# EasyEDA schematic SCH_Pico-android-remote_2025-09-06.json
TITLE: pico-GB-printer + remote control; REV: 1.0; Date: 2025-09-03; Sheet: 1/1; Drawn By: raphael.boichot; Company: Raphaël BOICHOT
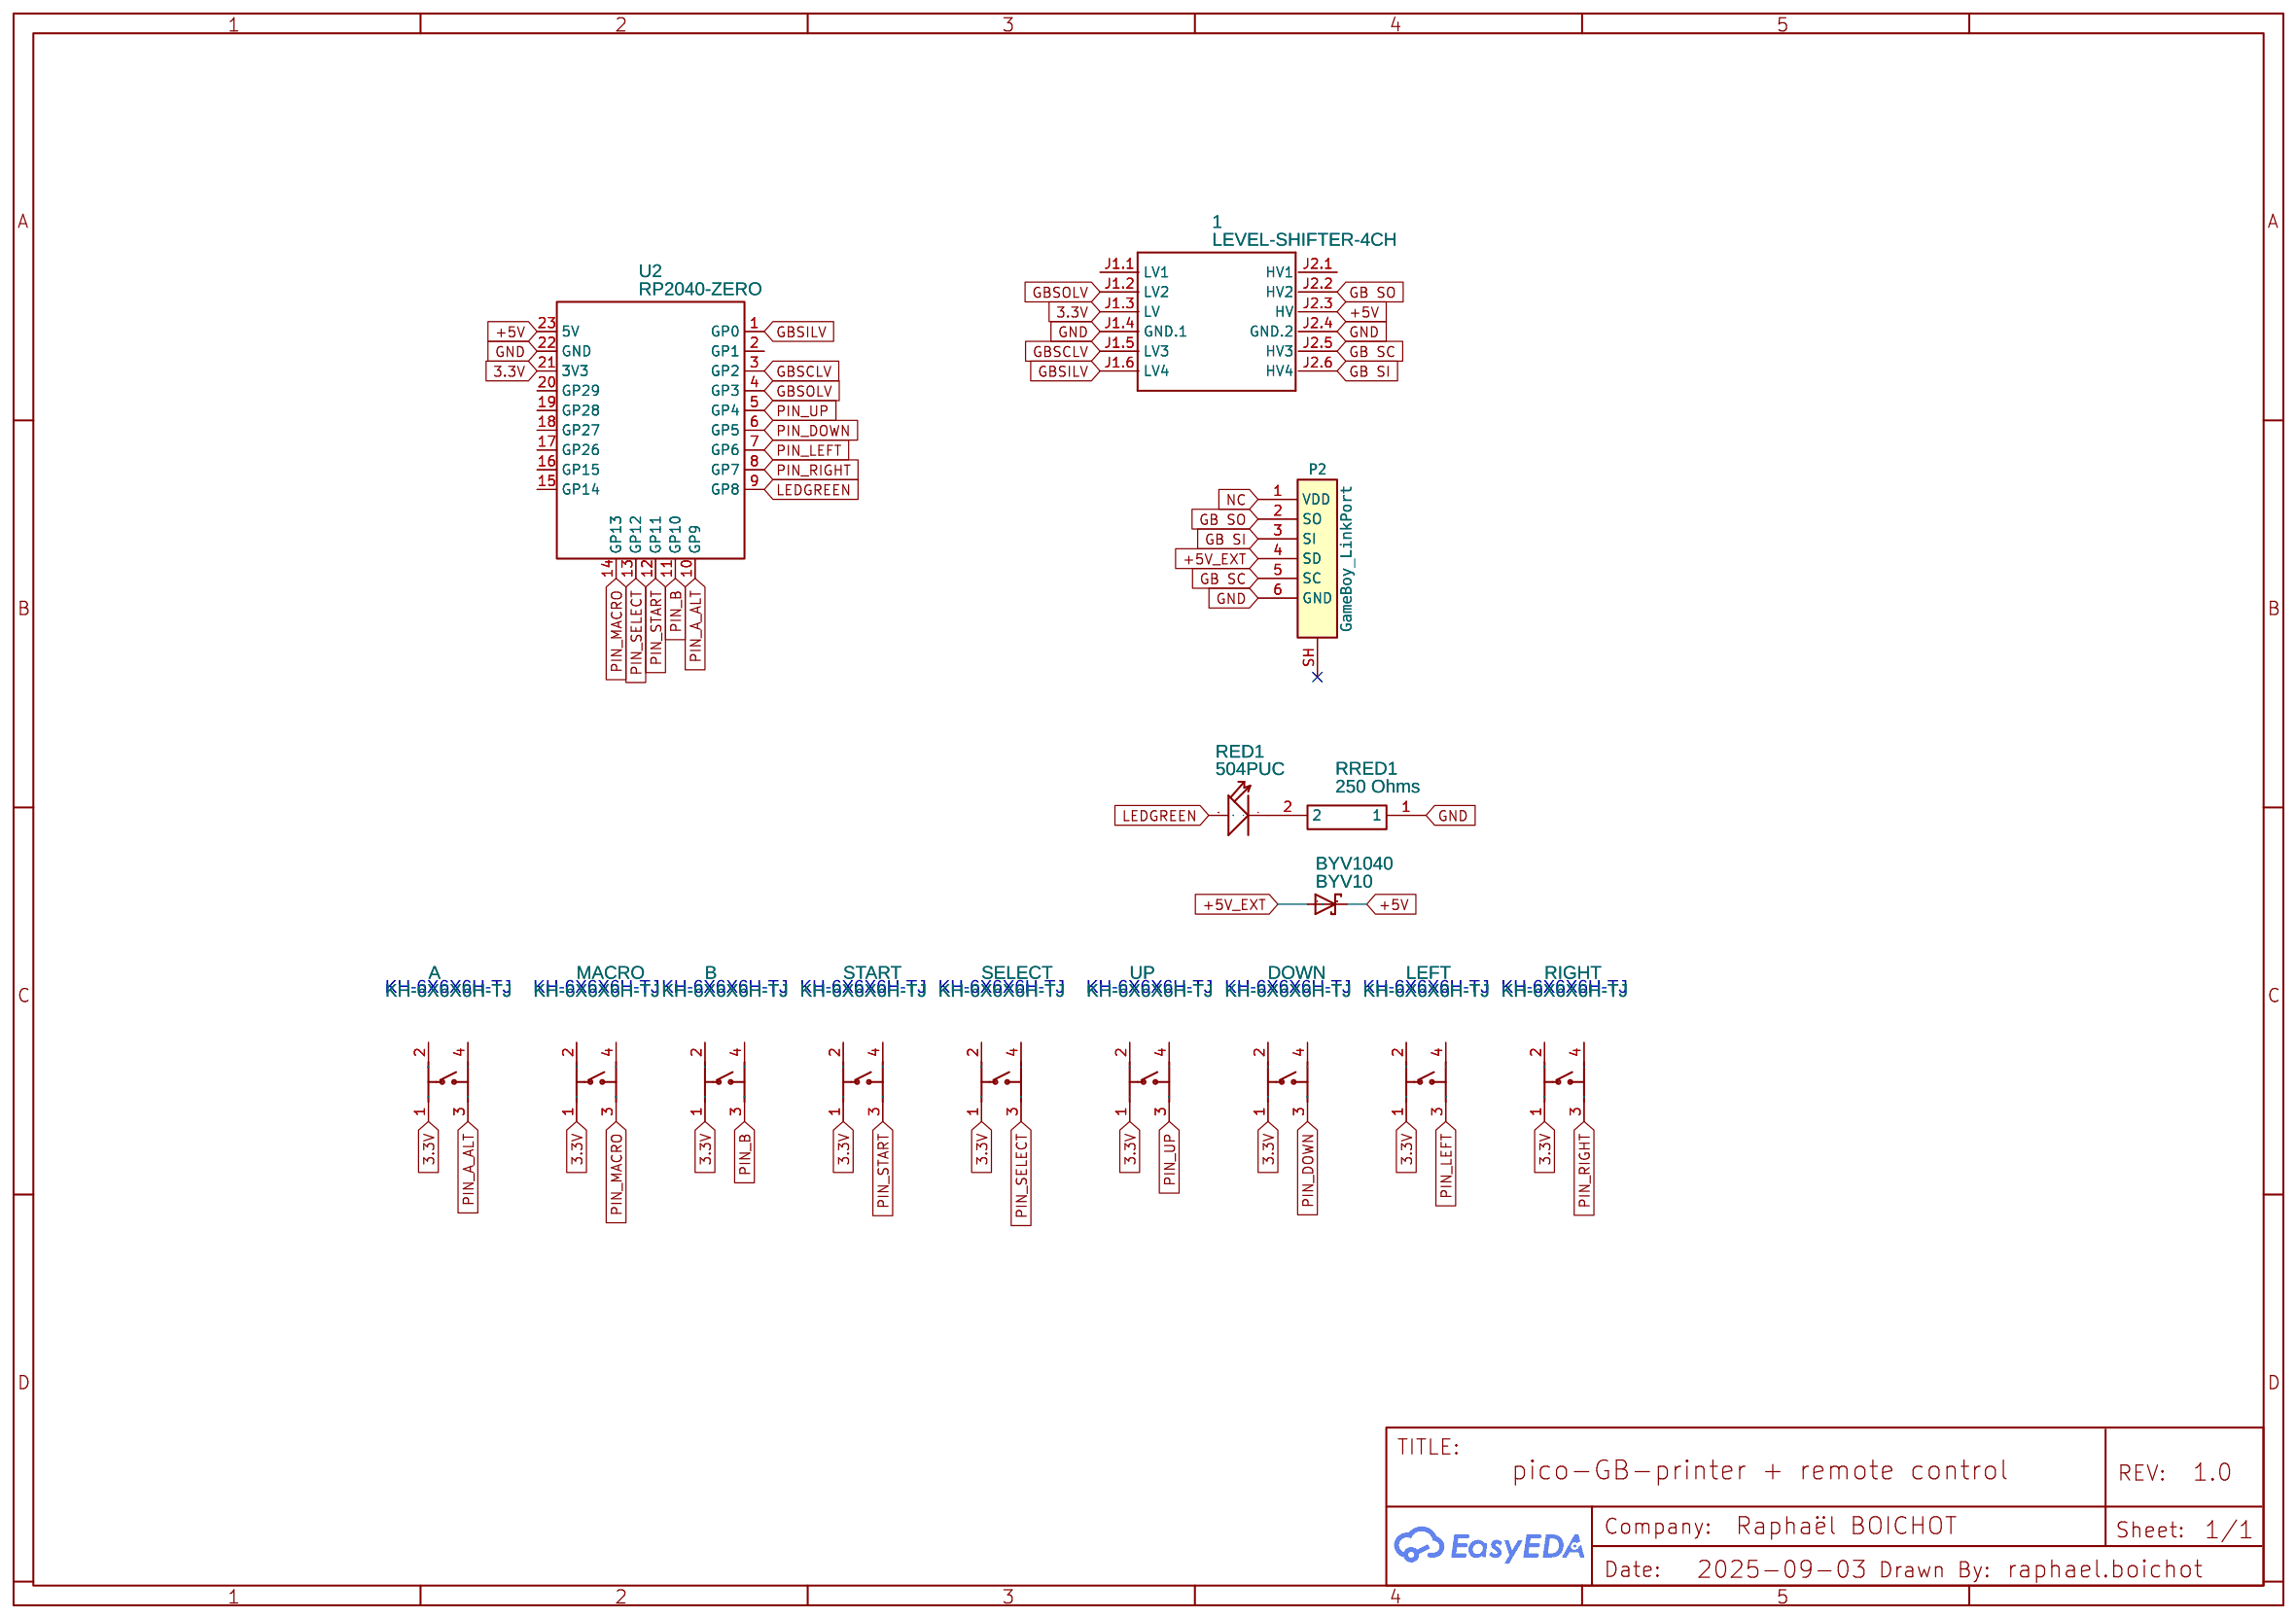
[diagram p0: schematic sheet]

## Parts
1  LEVEL-SHIFTER-4CH  [LEVEL-SHIFTER-4CH]
A  KH-6X6X6H-TJ  [SW-TH_4P-L6.0-W6.0-P4.50-LS6.5]
B  KH-6X6X6H-TJ  [SW-TH_4P-L6.0-W6.0-P4.50-LS6.5]
BYV1040  BYV10  [DO41-10]
DOWN  KH-6X6X6H-TJ  [SW-TH_4P-L6.0-W6.0-P4.50-LS6.5]
LEFT  KH-6X6X6H-TJ  [SW-TH_4P-L6.0-W6.0-P4.50-LS6.5]
MACRO  KH-6X6X6H-TJ  [SW-TH_4P-L6.0-W6.0-P4.50-LS6.5]
P2  GameBoy_LinkPort  [GAMEBOY_LINKPORT_MGB_HORIZONTAL]
RED1  504PUC  [LED2-2.54-D5.0MM]
RIGHT  KH-6X6X6H-TJ  [SW-TH_4P-L6.0-W6.0-P4.50-LS6.5]
RRED1  250 Ohms  [RESISTOR]
SELECT  KH-6X6X6H-TJ  [SW-TH_4P-L6.0-W6.0-P4.50-LS6.5]
START  KH-6X6X6H-TJ  [SW-TH_4P-L6.0-W6.0-P4.50-LS6.5]
U2  RP2040-ZERO  [RP2040-ZERO]
UP  KH-6X6X6H-TJ  [SW-TH_4P-L6.0-W6.0-P4.50-LS6.5]

## Library data of the parts
1 = LEVEL-SHIFTER-4CH: Contributor: Thafhan Fathur Rahman
A B DOWN LEFT MACRO RIGHT SELECT START UP = KH-6X6X6H-TJ: Supplier: LCSC; Supplier Part: C2837516; Manufacturer: kinghelm(金航标); Contributor: LCSC; JLCPCB Part Class: Extended Part
BYV1040 = BYV10: Contributor: vermashikhar20
RED1 = 504PUC: DIP LED Transparent-Purple-5mm;
RRED1 = RESITOR: Contributor: rander
U2 = RP2040-ZERO: Contributor: jhonatan6

## Nets
3.3V: 1.J1.3(LV) A.1 B.1 DOWN.1 LEFT.1 MACRO.1 RIGHT.1 SELECT.1 START.1 U2.21(3V3) UP.1
+5V: 1.J2.3(HV) BYV1040.C U2.23(5V)
+5V_EXT: BYV1040.A P2.4(SD)
GND: 1.J1.4(GND.1) 1.J2.4(GND.2) P2.6(GND) RRED1.1 U2.22(GND)
GB SC: 1.J2.5(HV3) P2.5(SC)
GB SI: 1.J2.6(HV4) P2.3(SI)
GB SO: 1.J2.2(HV2) P2.2(SO)
GBSCLV: 1.J1.5(LV3) U2.3(GP2)
GBSILV: 1.J1.6(LV4) U2.1(GP0)
GBSOLV: 1.J1.2(LV2) U2.4(GP3)
LEDGREEN: RED1.+ U2.9(GP8)
NC: P2.1(VDD)
PIN_A_ALT: A.3 U2.10(GP9)
PIN_B: B.3 U2.11(GP10)
PIN_DOWN: DOWN.3 U2.6(GP5)
PIN_LEFT: LEFT.3 U2.7(GP6)
PIN_MACRO: MACRO.3 U2.14(GP13)
PIN_RIGHT: RIGHT.3 U2.8(GP7)
PIN_SELECT: SELECT.3 U2.13(GP12)
PIN_START: START.3 U2.12(GP11)
PIN_UP: U2.5(GP4) UP.3
Net-(RED1--): RED1.- RRED1.2

Not connected (* = marked no-connect by the designer): 1 J1.1(LV1) J2.1(HV1); A 2 4; B 2 4; DOWN 2 4; LEFT 2 4; MACRO 2 4; P2 SH*; RIGHT 2 4; SELECT 2 4; START 2 4; U2 2(GP1) 15(GP14) 16(GP15) 17(GP26) 18(GP27) 19(GP28) 20(GP29); UP 2 4

## Notes on the sheet
- KH-6X6X6H-TJ
- KH-6X6X6H-TJ
- KH-6X6X6H-TJ
- KH-6X6X6H-TJ
- KH-6X6X6H-TJ
- KH-6X6X6H-TJ
- KH-6X6X6H-TJ
- KH-6X6X6H-TJ
- KH-6X6X6H-TJ
